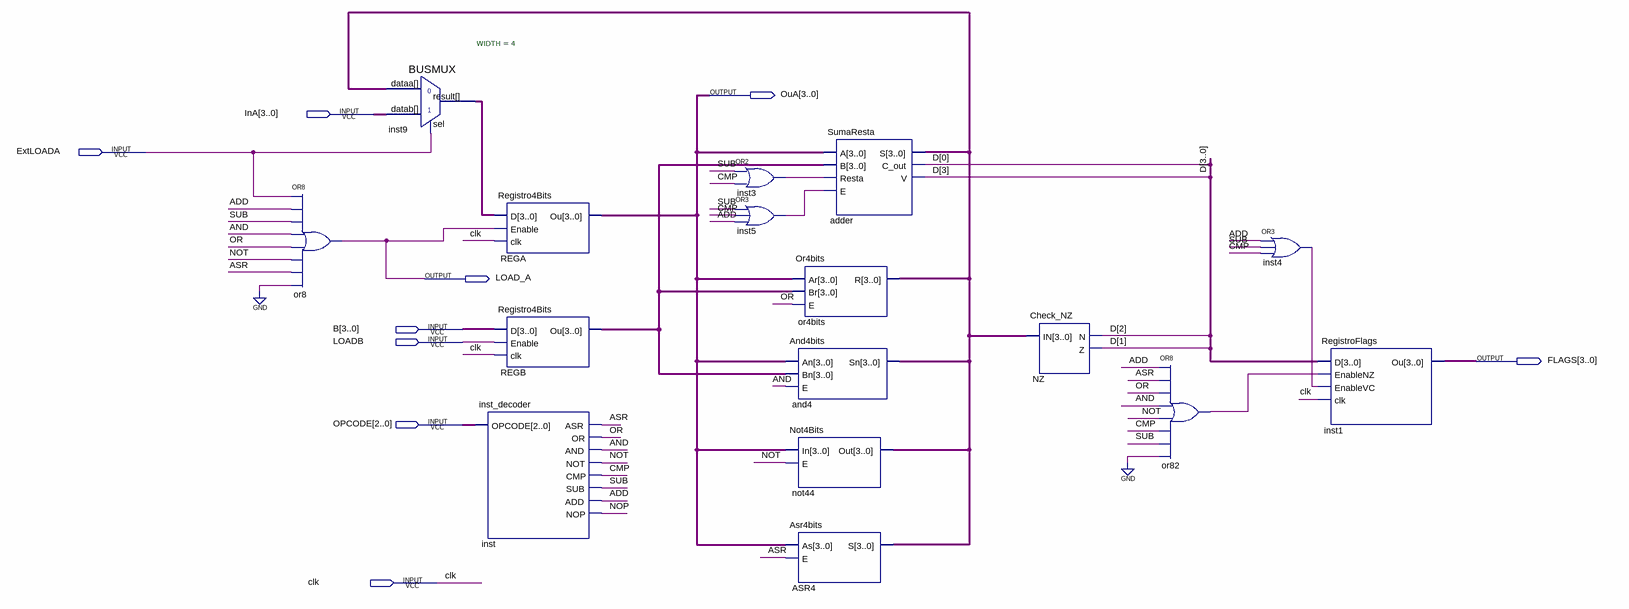
[diagram p0: schematic sheet]
// Quartus schematic integrador.bdf as structural Verilog: 16 symbols, 9 pins
module integrador (
  input  [3:0] InA,
  input  ExtLOADA,
  input  [3:0] B,
  input  LOADB,
  input  [2:0] OPCODE,
  input  clk,
  output [3:0] OuA,
  output LOAD_A,
  output [3:0] FLAGS
);

  wire ADD, AND, ASR, CMP, inst3_out, inst4_out, inst5_out, NOP, NOT, OR, or82_out, SUB;
  wire [3:0] and4_sn, D, inst9_result, REGB_ou;

  or or8 (LOAD_A, ExtLOADA, ADD, SUB, AND, OR, NOT, ASR, 1'b0);
  BUSMUX #(.WIDTH(4)) inst9 (.datab(InA), .sel(ExtLOADA), .dataa(and4_sn), .result(inst9_result));
  inst_decoder inst (
    .OPCODE(OPCODE), .ASR(ASR), .OR(OR), .AND(AND), .NOT(NOT), .CMP(CMP), .SUB(SUB), .ADD(ADD), .NOP(NOP));
  Registro4Bits REGA (.D(inst9_result), .Enable(LOAD_A), .clk(clk), .Ou(OuA));
  Registro4Bits REGB (.D(B), .Enable(LOADB), .clk(clk), .Ou(REGB_ou));
  or inst3 (inst3_out, SUB, CMP);
  or inst5 (inst5_out, SUB, CMP, ADD);
  And4bits and4 (.An(OuA), .Bn(REGB_ou), .E(AND), .Sn(and4_sn));
  Not4Bits not44 (.In(OuA), .E(NOT), .Out(and4_sn));
  Asr4bits ASR4 (.As(OuA), .E(ASR), .S(and4_sn));
  SumaResta adder (.A(OuA), .B(REGB_ou), .Resta(inst3_out), .E(inst5_out), .S(and4_sn), .C_out(D[0]), .V(D[3]));
  Or4bits or4bits (.Ar(OuA), .Br(REGB_ou), .E(OR), .R(and4_sn));
  Check_NZ NZ (.IN(and4_sn), .N(D[2]), .Z(D[1]));
  or or82 (or82_out, ADD, ASR, OR, AND, NOT, CMP, SUB, 1'b0);
  or inst4 (inst4_out, ADD, SUB, CMP);
  RegistroFlags inst1 (.D(D), .EnableNZ(or82_out), .EnableVC(inst4_out), .clk(clk), .Ou(FLAGS));
endmodule
